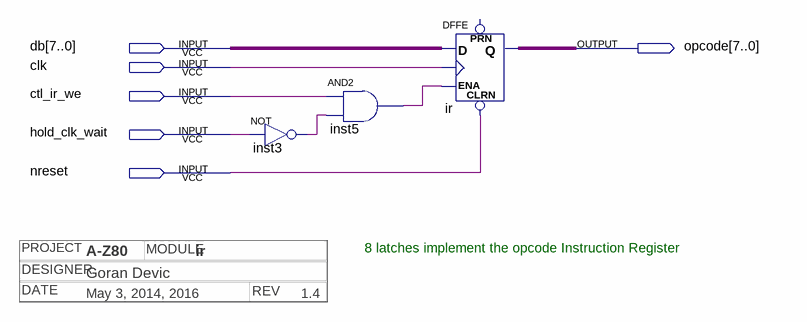
[diagram p0: schematic sheet]
// Quartus schematic ir.bdf as structural Verilog: 3 symbols, 6 pins
// Title block: DATE: May 3, 2014, 2016; DESIGNER: Goran Devic; MODULE: ir; PROJECT: A-Z80; REV: 1.4
module ir (
  input  [7:0] db,
  input  clk,
  input  ctl_ir_we,
  input  hold_clk_wait,
  input  nreset,
  output [7:0] opcode
);

  wire inst3_out, inst5_out;

  not inst3 (inst3_out, hold_clk_wait);
  and inst5 (inst5_out, ctl_ir_we, inst3_out);
  DFFE ir[7:0] (.CLRN(nreset), .D(db), .CLK(clk), .ENA(inst5_out), .Q(opcode));  // open: PRN

  // Notes on the sheet:
  //   8 latches implement the opcode Instruction Register
endmodule
